# Altium schematic sheet ejemplo_carga.SchDoc
size 127 x 101 mm; PageSetup: Record=PageOptions|CenterHorizontal=True|CenterVertical=True|PrintScale=1.05|XCorrection=1.00|YCorrection=1.00|PrintKind=0|BorderSize=5000000|LeftOffset=0|BottomOffset=0|Orientation=2|PaperLength=1000|PaperWidth=1000|Scale=100|PaperSource=7|PrintQuality=-4|MediaType=1|DitherType=10|PaperKind=A4 (8.2 x 11.7 in; 210 x 297 mm)|PrintScaleMode=1
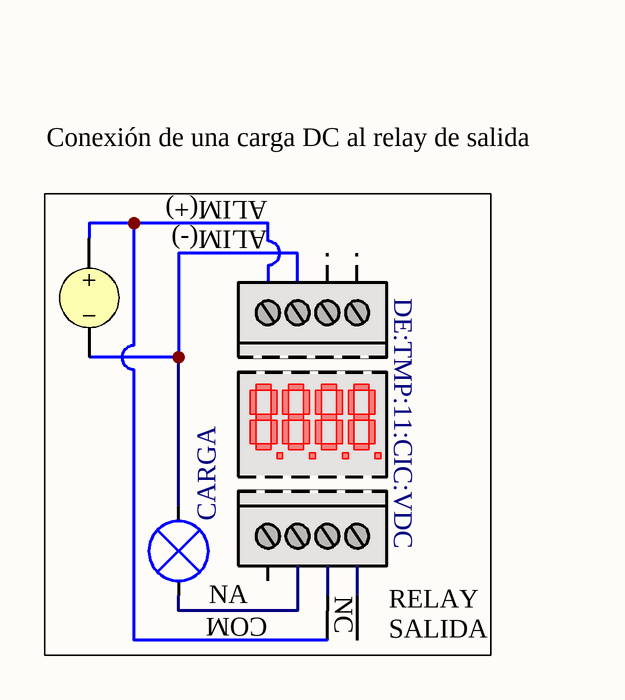
[diagram p0: ejemplo_carga.SchDoc]

## Parts
CARGA  Lamp  [bornera2]  (value not drawn)
V2233  VOLTAJE DE  (value not drawn)

## Nets

Not connected (* = marked no-connect by the designer): CARGA 1 2; V2233 1 2

## Notes on the sheet
- Conexión de una carga DC al relay de salida
- (near V2233) ALIM(+)
- (near V2233) ALIM(-)
- DE:TMP:11:CIC:VDC
- (near CARGA) NA
- (near CARGA) COM
- NC
- RELAY SALIDA

## Library data of the parts
CARGA = Lamp: Indicator; Price: ?
V2233 = VSRC: Voltage Source; Note: PCB Footprint - Not required; Published: 8-Jun-2000; LatestRevisionDate: 17-Jul-2002; LatestRevisionNote: Re-released for DXP Platform.; PackageReference: Not Applicable; Publisher: Altium Limited